# Altium schematic sheet SDtop.SchDoc
size A4; DocumentNumber: 9; SheetNumber: 9; SheetTotal: 21; SheetName: SD Card
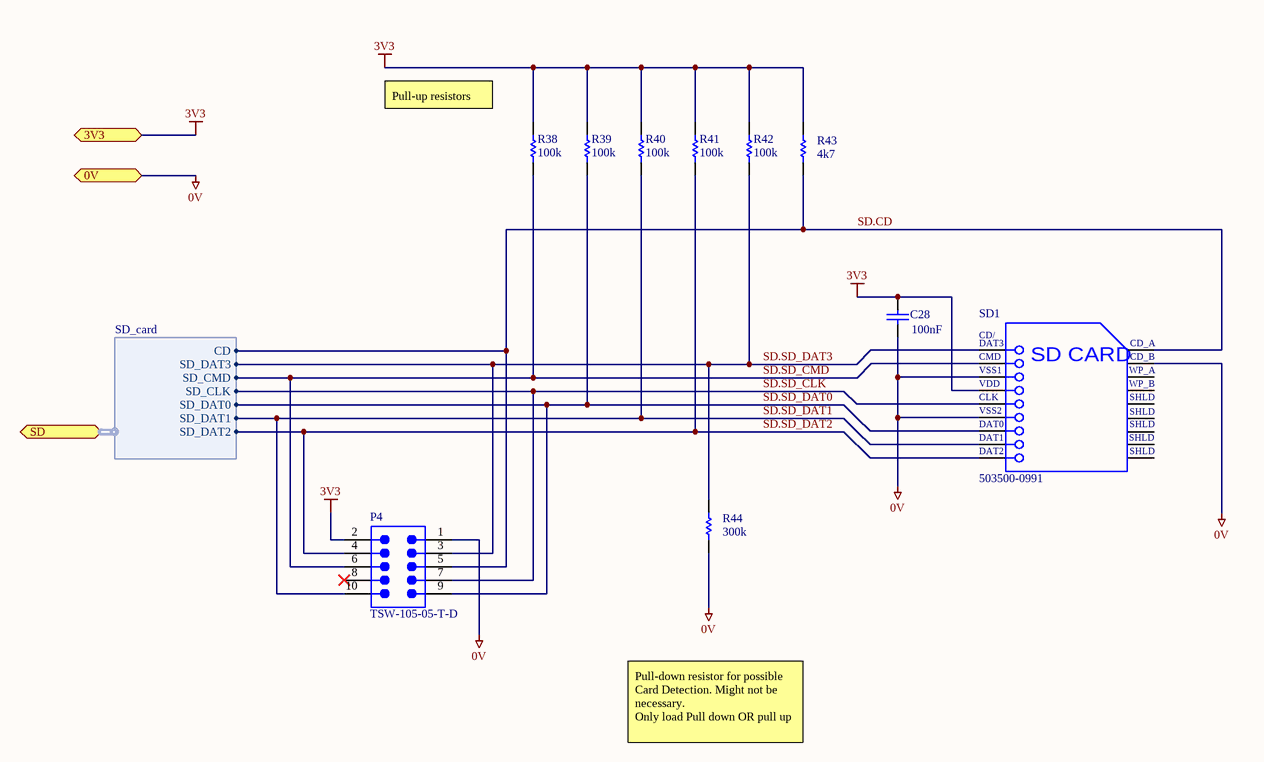
[diagram p0: SDtop.SchDoc]

## Parts
C28  value 100nF  [CAPC0603(1608)100_M]  (hidden comment: CAP 100nF 16V 0603(1608))
P4  TSW-105-05-T-D  [SMTC-TSW-105-05-X-D]
R38  value 100k  [RESC0603(1608)_N]  (hidden comment: 100K 1% 0603(1608))
R39  value 100k  [RESC0603(1608)_N]  (hidden comment: 100K 1% 0603(1608))
R40  value 100k  [RESC0603(1608)_N]  (hidden comment: 100K 1% 0603(1608))
R41  value 100k  [RESC0603(1608)_N]  (hidden comment: 100K 1% 0603(1608))
R42  value 100k  [RESC0603(1608)_N]  (hidden comment: 100K 1% 0603(1608))
R43  value 4k7  [RESC0603(1608)_N]  (hidden comment: 4K7 1% 0603(1608))
R44  value 300k  [RESC0603(1608)_M]  (hidden comment: 300K 1% 0603(1608))
SD1  503500-0991  [MOLX-503500-0991_V]

## Ports
0V, 3V3, SD (harness SD_card)

## Harnesses
SD_card: SD_CMD, SD_CLK, SD_DAT0, SD_DAT1, SD_DAT2, SD_DAT3, CD

## Nets
0V: C28.1 P4.1 R44.1 SD1.3(VSS1) SD1.6(VSS2) SD1.11(CD_B) ; port 0V
3V3: C28.2 P4.2 R38.2 R39.2 R40.2 R41.2 R42.2 R43.2 SD1.4(VDD) ; port 3V3
SD.CD: P4.5 R43.1 SD1.10(CD_A) ; port SD.CD
SD.SD_CLK: P4.7 SD1.5(CLK) ; port SD.SD_CLK
SD.SD_CMD: P4.6 R38.1 SD1.2(CMD) ; port SD.SD_CMD
SD.SD_DAT0: P4.9 R39.1 SD1.7(DAT0) ; port SD.SD_DAT0
SD.SD_DAT1: P4.10 R40.1 SD1.8(DAT1) ; port SD.SD_DAT1
SD.SD_DAT2: P4.4 R41.1 SD1.9(DAT2) ; port SD.SD_DAT2
SD.SD_DAT3: P4.3 R42.1 R44.2 SD1.1(CD/DAT3) ; port SD.SD_DAT3

Not connected (* = marked no-connect by the designer): P4 8*; SD1 12(WP_A) 13(WP_B) 14(SHLD1) 15(SHLD2) 16(SHLD3) 17(SHLD4) 18(SHLD5)

## Notes on the sheet
- (near R38) Pull-up resistors
- Pull-down resistor for possible Card Detection. Might not be necessary.
  Only load Pull down OR pull up
- Board:
- Version:
- Sheetname:
- Subject:
- Group:
- Sheet
- of
- Shematic file:
- (in symbol CMP-1676-00006-1) CD/; DAT3; SD CARD; SHLD

## Library data of the parts
C28 = CMP-1035-02583-1: CAP 100nF 16V ±5% 0603 (1608 Metric) Thickness 1mm SMD; Tolerance: Â±5%; Case-Metric: 1608; Case-EIA: 0603; Rated Voltage: 16 V; Max Thickness: 1 mm; Technology: SMT
P4 = CMP-1024-00361-1: Manufacturer: Samtec; Pitch: 2.54 mm; PackageReference: TSW-105-05-X-D; ComponentLink2Description: Datasheet; ComponentLink1URL: http://www.samtec.com; PackageVersion: DM, 8/1988; Orientation: Vertical; RoHS: True; ComponentLink3Description: Package Specification; PartNumber: TSW-105-05-T-D; Temperature Range: -55 to 105 degC; DatasheetVersion: F-214; PackageDescription: .025[0.64] SQ. Post Terminal Strip Assembly; ComponentLink1Description: Manufacturer URL; Mounting Technology: Through-hole; ComponentLink2URL: http://www.samtec.com/documents/webfiles/pdf/TSW_TH.PDF; ComponentLink3URL: http://www.samtec.com/documents/webfiles/cpdf/TSW-XXX-XX-XXX-X-XX-XXX-MKT.pdf
R38-R42 = CMP-1012-00736-1: 100K 0.1W 1% 0603 (1608 Metric)  SMD; Case-Metric: 1608; Case-EIA: 0603; Power: 0.1 W; Tolerance: 1 %; Technology: SMT
R43 = CMP-1012-00586-1: 4K7 0.1W 1% 0603 (1608 Metric)  SMD; Case-EIA: 0603; Case-Metric: 1608; Power: 0.1 W; Tolerance: 1 %; Technology: SMT
R44 = CMP-1012-00788-1: 300K 0.1W 1% 0603 (1608 Metric)  SMD; Case-Metric: 1608; Case-EIA: 0603; Technology: SMT; Power: 0.1 W; Tolerance: 1 %
SD1 = CMP-1676-00006-1: SD and Combo Memory Card Connector, 9 Position Surface Mount, -25 to 85 degC, RoHS, Tape and Reel; Nominal Supply Current: 3 mA; Max Supply Voltage: 5.5 V; Output Current: 5 mA; Min Supply Voltage: 2.5 V; Case\Package: Axial; Pins: 3; ComponentLink2Description: Datasheet; REACH SVHC: Unknown; RoHSCompliant: true; Height: 6.95 mm; Max Operating Temperature: 85 degC; ComponentLink2URL: http://www.molex.com/pdm_docs/sd/5035000991_sd.pdf; PackageDescription: SD Card Connector, 9 Position Surface Mount, Length 28.6 mm, Height 3.1 mm; ComponentLink1URL: http://www.molex.com/; Mount: Through Hole; Packaging: Bulk; Width: 4.8 mm; Length: 5 mm; PackageReference: 503500-0991; ComponentLink1Description: Manufacturer URL; DatasheetVersion: Rev. B, 02/2010; Radiation Hardening: No; Package Quantity: 1500; Min Operating Temperature: -25 degC